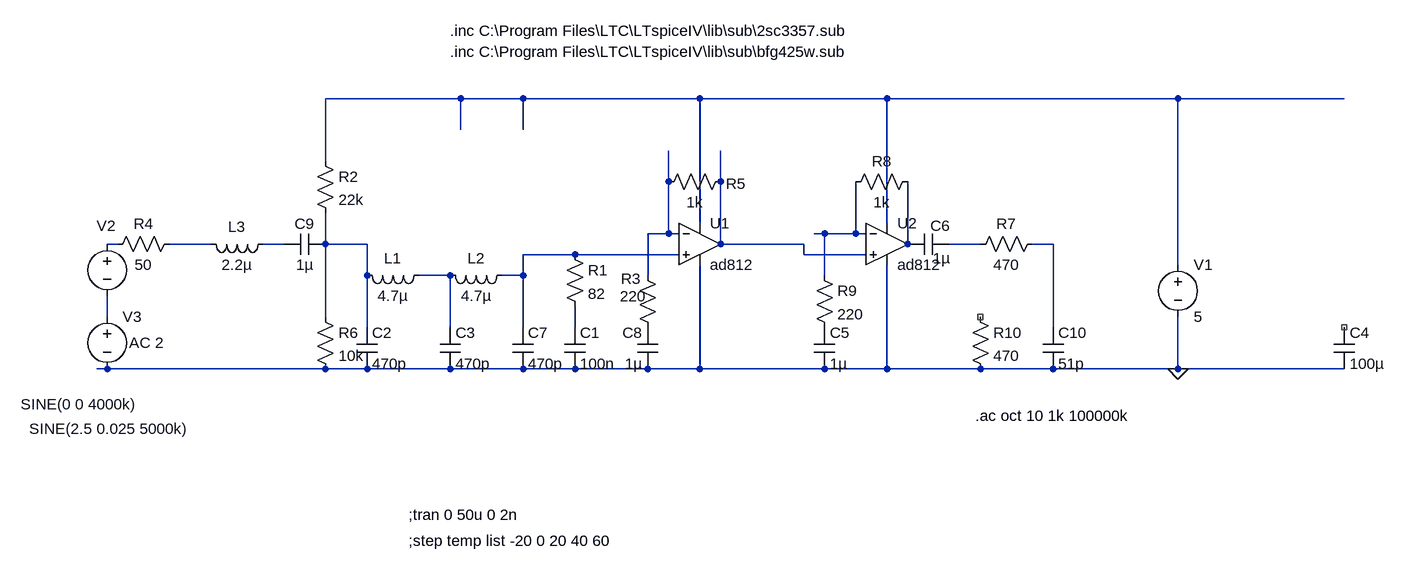
[diagram p0: schematic bb_amp.asc]
bb_amp.asc, the LTspice schematic file:
Version 4
SHEET 1 1960 680
WIRE 528 -48 320 -48
WIRE 624 -48 528 -48
WIRE 896 -48 624 -48
WIRE 1184 -48 896 -48
WIRE 1632 -48 1184 -48
WIRE 1888 -48 1632 -48
WIRE 528 0 528 -48
WIRE 624 0 624 -48
WIRE 320 48 320 -48
WIRE 848 80 848 32
WIRE 928 80 928 32
WIRE 896 144 896 -48
WIRE 1184 144 1184 -48
WIRE 848 160 848 80
WIRE 848 160 816 160
WIRE 864 160 848 160
WIRE 1088 160 1072 160
WIRE 1136 160 1136 80
WIRE 1136 160 1088 160
WIRE 1152 160 1136 160
WIRE 0 176 -16 176
WIRE 144 176 80 176
WIRE 256 176 224 176
WIRE 320 176 320 128
WIRE 384 176 320 176
WIRE 928 176 928 80
WIRE 1056 176 928 176
WIRE 1216 176 1216 80
WIRE 1328 176 1280 176
WIRE 1440 176 1408 176
WIRE 704 192 624 192
WIRE 864 192 704 192
WIRE 1056 192 1056 176
WIRE 1152 192 1056 192
WIRE 1632 208 1632 -48
WIRE 384 224 384 176
WIRE 512 224 464 224
WIRE 624 224 624 192
WIRE 624 224 592 224
WIRE 816 224 816 160
WIRE 1088 224 1088 160
WIRE -16 288 -16 256
WIRE 320 288 320 176
WIRE 384 304 384 224
WIRE 512 304 512 224
WIRE 624 304 624 224
WIRE 704 304 704 272
WIRE 1440 304 1440 176
WIRE -16 368 -32 368
WIRE 320 368 -16 368
WIRE 384 368 320 368
WIRE 512 368 384 368
WIRE 624 368 512 368
WIRE 704 368 624 368
WIRE 816 368 704 368
WIRE 896 368 896 208
WIRE 896 368 816 368
WIRE 1088 368 896 368
WIRE 1184 368 1184 208
WIRE 1184 368 1088 368
WIRE 1328 368 1184 368
WIRE 1440 368 1328 368
WIRE 1632 368 1632 288
WIRE 1632 368 1440 368
WIRE 1888 368 1632 368
FLAG 1632 368 0
SYMBOL voltage 1632 192 R0
WINDOW 123 0 0 Left 2
WINDOW 39 0 0 Left 2
SYMATTR InstName V1
SYMATTR Value 5
SYMBOL voltage -16 272 R0
WINDOW 3 -120 188 Left 2
WINDOW 123 34 56 Left 2
WINDOW 39 0 0 Left 2
SYMATTR Value SINE(2.5 0.025 5000k)
SYMATTR Value2 AC 2
SYMATTR InstName V3
SYMBOL res 96 160 R90
WINDOW 0 0 56 VBottom 2
WINDOW 3 32 56 VTop 2
SYMATTR InstName R4
SYMATTR Value 50
SYMBOL res 944 64 R90
WINDOW 0 35 -8 VBottom 2
WINDOW 3 32 56 VTop 2
SYMATTR InstName R5
SYMATTR Value 1k
SYMBOL voltage -16 160 R0
WINDOW 3 -133 262 Left 2
WINDOW 123 31 78 Left 2
WINDOW 39 0 0 Left 2
WINDOW 0 -16 -12 Left 2
SYMATTR Value SINE(0 0 4000k)
SYMATTR InstName V2
SYMBOL res 1232 64 R90
WINDOW 0 0 56 VBottom 2
WINDOW 3 32 56 VTop 2
SYMATTR InstName R8
SYMATTR Value 1k
SYMBOL cap 1072 304 R0
SYMATTR InstName C5
SYMATTR Value 1µ
SYMBOL res 1072 208 R0
SYMATTR InstName R9
SYMATTR Value 220
SYMBOL cap 1280 160 R90
WINDOW 0 3 14 VBottom 2
WINDOW 3 22 12 VTop 2
SYMATTR InstName C6
SYMATTR Value 1µ
SYMBOL res 1312 272 R0
SYMATTR InstName R10
SYMATTR Value 470
SYMBOL res 688 176 R0
SYMATTR InstName R1
SYMATTR Value 82
SYMBOL cap 688 304 R0
SYMATTR InstName C1
SYMATTR Value 100n
SYMBOL cap 368 304 R0
SYMATTR InstName C2
SYMATTR Value 470p
SYMBOL cap 496 304 R0
SYMATTR InstName C3
SYMATTR Value 470p
SYMBOL cap 608 304 R0
SYMATTR InstName C7
SYMATTR Value 470p
SYMBOL ind 480 208 R90
WINDOW 0 5 56 VBottom 2
WINDOW 3 32 56 VTop 2
SYMATTR InstName L1
SYMATTR Value 4.7µ
SYMATTR SpiceLine Rser=3
SYMBOL ind 608 208 R90
WINDOW 0 5 56 VBottom 2
WINDOW 3 32 56 VTop 2
SYMATTR InstName L2
SYMATTR Value 4.7µ
SYMATTR SpiceLine Rser=3
SYMBOL res 800 208 R0
WINDOW 0 -25 21 Left 2
WINDOW 3 -27 48 Left 2
SYMATTR InstName R3
SYMATTR Value 220
SYMBOL cap 832 368 R180
WINDOW 0 24 56 Left 2
WINDOW 3 24 8 Left 2
SYMATTR InstName C8
SYMATTR Value 1µ
SYMBOL cap 320 160 R90
WINDOW 0 0 32 VBottom 2
WINDOW 3 32 32 VTop 2
SYMATTR InstName C9
SYMATTR Value 1µ
SYMBOL res 304 32 R0
SYMATTR InstName R2
SYMATTR Value 22k
SYMBOL res 304 272 R0
SYMATTR InstName R6
SYMATTR Value 10k
SYMBOL cap 1872 304 R0
SYMATTR InstName C4
SYMATTR Value 100µ
SYMBOL res 1424 160 R90
WINDOW 0 0 56 VBottom 2
WINDOW 3 32 56 VTop 2
SYMATTR InstName R7
SYMATTR Value 470
SYMBOL cap 1424 304 R0
SYMATTR InstName C10
SYMATTR Value 51p
SYMBOL ad812 896 176 R0
SYMATTR InstName U1
SYMBOL ad812 1184 176 R0
SYMATTR InstName U2
SYMBOL ind 240 160 R90
WINDOW 0 5 56 VBottom 2
WINDOW 3 32 56 VTop 2
SYMATTR InstName L3
SYMATTR Value 2.2µ
TEXT 448 592 Left 2 !;tran 0 50u 0 2n
TEXT 448 632 Left 2 !;step temp list -20 0 20 40 60
TEXT 512 -152 Left 2 !.inc C:\\Program Files\\LTC\\LTspiceIV\\lib\\sub\\2sc3357.sub
TEXT 512 -120 Left 2 !.inc C:\\Program Files\\LTC\\LTspiceIV\\lib\\sub\\bfg425w.sub
TEXT 1320 440 Left 2 !.ac oct 10 1k 100000k

The netlist it stands for:
* bb_amp.asc
V1 N001 0 5
V3 N014 0 SINE(2.5 0.025 5000k) AC 2
R4 N006 N005 50
R5 N003 N002 1k
V2 N005 N014 SINE(0 0 4000k)
R8 N009 N004 1k
C5 P001 0 1µ
R9 N004 P001 220
C6 N010 N009 1µ
R10 NC_01 0 470
R1 N012 N015 82
C1 N015 0 100n
C2 N008 0 470p
C3 N013 0 470p
C7 N012 0 470p
L1 N013 N008 4.7µ Rser=3
L2 N012 N013 4.7µ Rser=3
R3 N002 P002 220
C8 0 P002 1µ
C9 N008 N007 1µ
R2 N001 N008 22k
R6 N008 0 10k
C4 NC_02 0 100µ
R7 N011 N010 470
C10 N011 0 51p
* U1: ad812 (symbol ad812 not available, pins judged from their places): In+=N012 In-=N002 V+=N001 V-=0 OUT=N003
* U2: ad812 (symbol ad812 not available, pins judged from their places): In+=N003 In-=N004 V+=N001 V-=0 OUT=N009
L3 N007 N006 2.2µ
;tran 0 50u 0 2n
;step temp list -20 0 20 40 60
.inc C:\Program Files\LTC\LTspiceIV\lib\sub\2sc3357.sub
.inc C:\Program Files\LTC\LTspiceIV\lib\sub\bfg425w.sub
.ac oct 10 1k 100000k
.backanno
.end